# EAGLE board DRI-21700-flexpcb-12s4p (EAGLE 9.6.1)
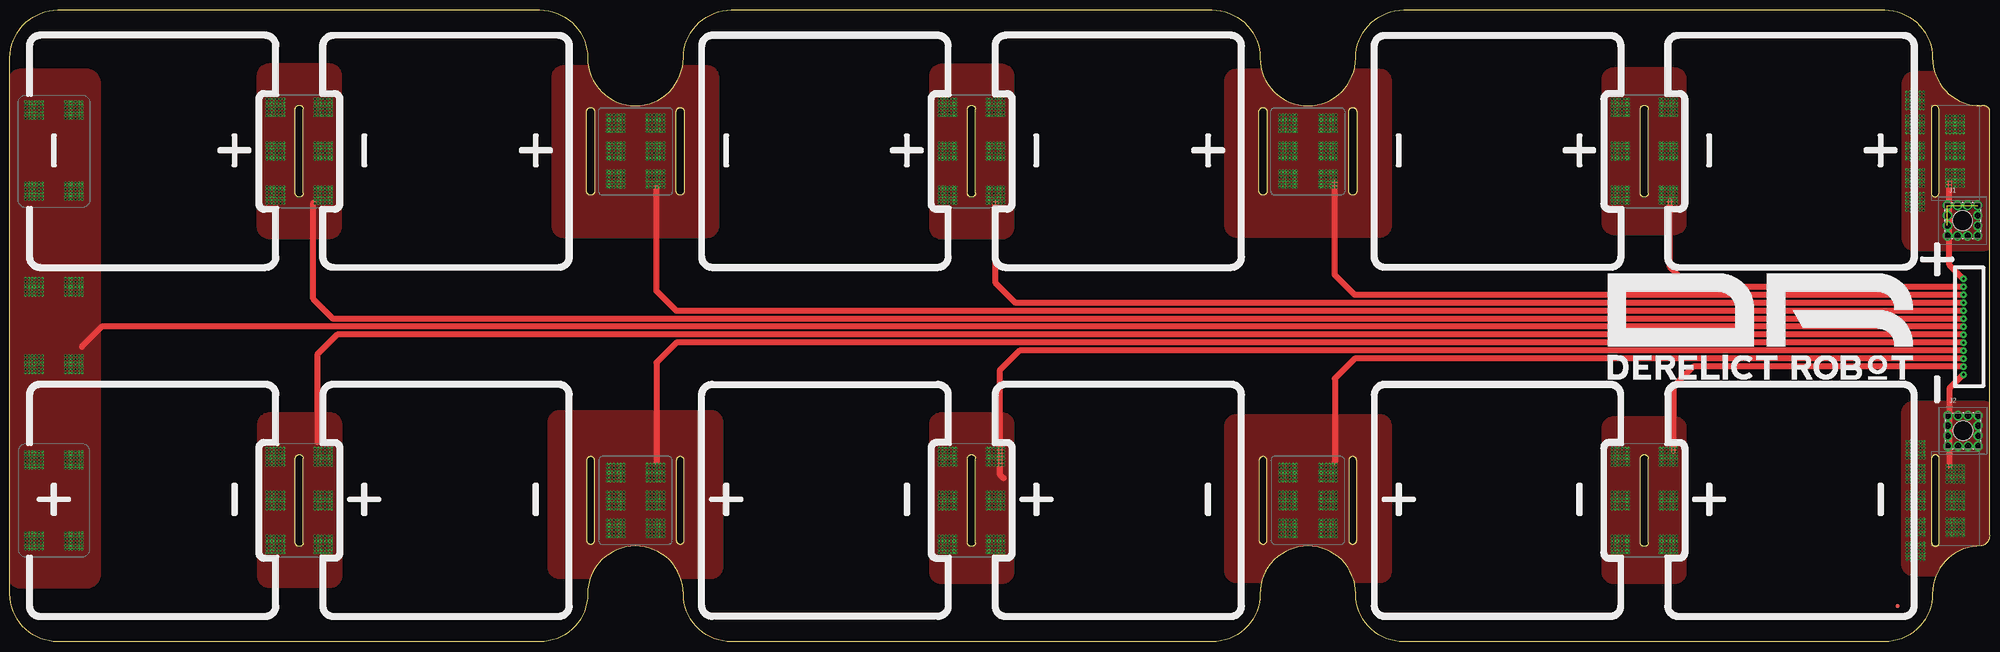
[diagram p1: board, top side]
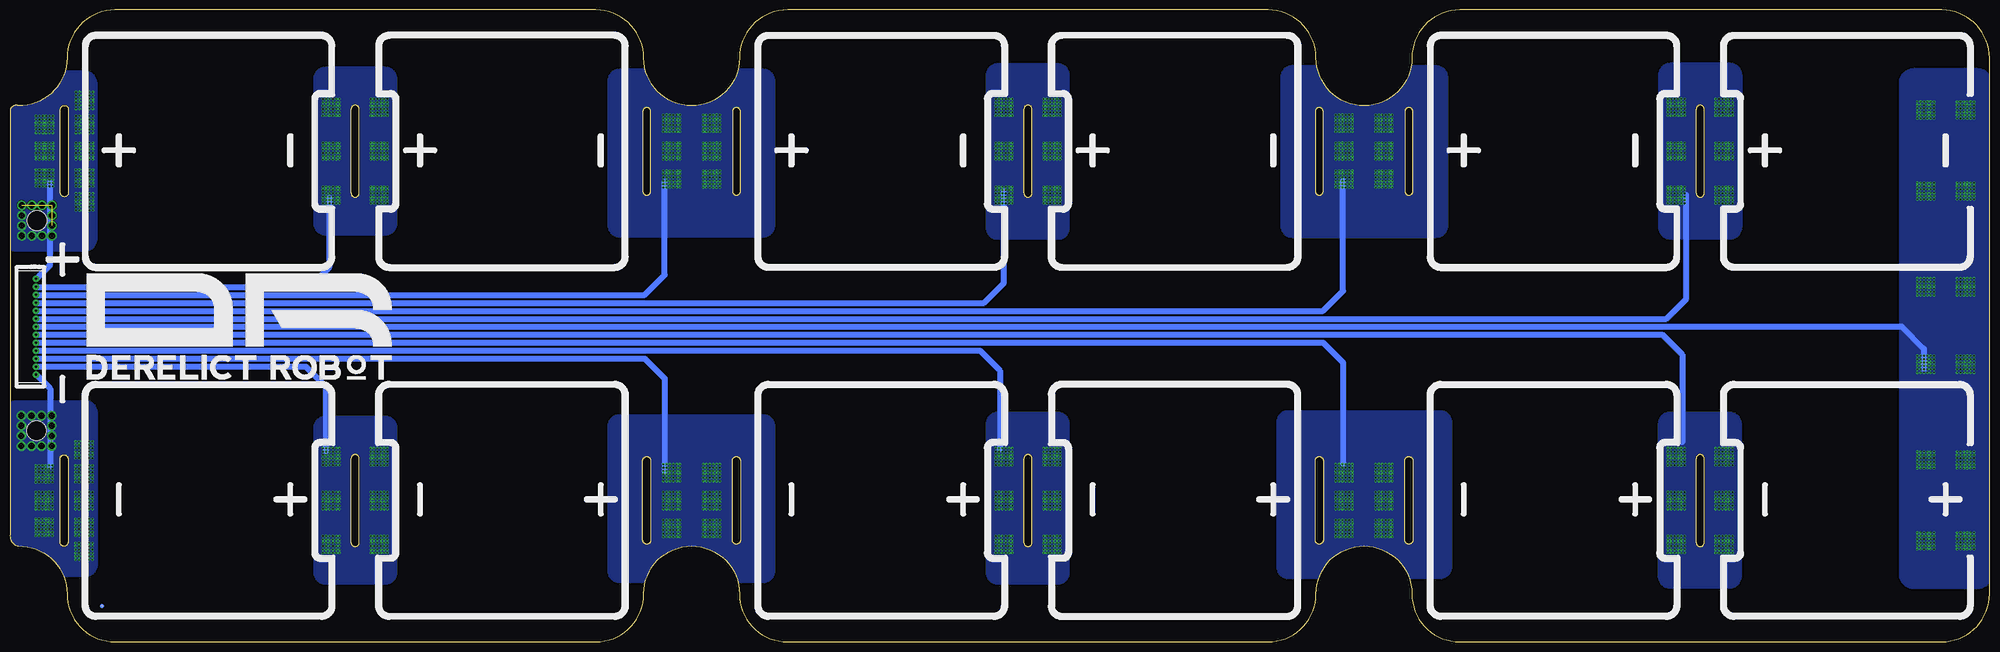
[diagram p2: board, bottom side, seen from below]

Size 496.05 x 158.4 mm. Coordinates in mm from the lower left corner, seen from the top.
Outline: 301.25,0 180.75,0 arc-90 168.75,12 arc180 144.75,12 arc-90 132.75,0 12,0 arc-90 0,12 0,146.4 arc-90 12,158.4 132.75,158.4 arc-90 144.75,146.4 arc180 168.75,146.4 arc-90 180.75,158.4 301.25,158.4 arc-90 313.25,146.4 arc180 337.25,146.4 arc-90 349.25,158.4 469.75,158.4 arc-90 481.75,146.4 arc91 493.96,134.4 arc-91 496,133.4 496,27 arc-91 493.96,24 arc91 481.75,12 arc-90 469.75,0 349.25,0 arc-90 337.25,12 arc180 313.25,12 arc-90 301.25,0
Outline: 166.97,112.95 166.97,132.95 arc-180 168.97,132.95 168.97,112.95 arc-180 166.97,112.95
Outline: 313.01,132.95 arc-180 315.01,132.95 315.01,112.95 arc-180 313.01,112.95 313.01,132.95
Outline: 146.51,112.95 arc-180 144.51,112.95 144.51,132.95 arc-180 146.51,132.95 146.51,112.95
Outline: 168.97,45.45 arc180 166.97,45.45 166.97,25.45 arc180 168.97,25.45 168.97,45.45
Outline: 337.47,132.95 337.47,112.95 arc-180 335.47,112.95 335.47,132.95 arc-180 337.47,132.95
Outline: 335.47,45.45 335.47,25.45 arc180 337.47,25.45 337.47,45.45 arc180 335.47,45.45
Outline: 315.01,25.45 315.01,45.45 arc180 313.01,45.45 313.01,25.45 arc180 315.01,25.45
Outline: 146.51,45.45 arc180 144.51,45.45 144.51,25.45 arc180 146.51,25.45 146.51,45.45
Copper layers (1*16): Top 0.035mm / dielectric 1.5mm / Bottom 0.035mm
Design rules "SparkFun-2-layer-FAB-LIMIT": minimum track width 4mil, minimum drill 6mil, track to track 4mil, track to pad 4mil, pad to pad 4mil, via to via 4mil, smd to smd 4mil, copper to edge 4mil, drill to drill 4mil, minimum pad ring 5mil, minimum via ring 5mil, stop-mask expansion 4mil, vias tented up to drill 25mil, thermal gap 10mil

## Footprints (pad centres in the part's own frame; a part is rotated, then mirrored left to right if it is on the bottom)
FIDUCIAL-1X2 = smd 1 x 1: 1 0,0
7460408 = drill 1.57 pad 2.3: 1 -3.81,-3.81; 2 -1.27,-3.81; 3 1.27,-3.81; 4 3.81,-3.81; 5 3.81,-1.27; 6 3.81,1.27; 7 3.81,3.81; 8 1.27,3.81; 9 -1.27,3.81; 10 -3.81,3.81; 11 -3.81,1.27; 12 -3.81,-1.27 | hole 5: 0,0
13P-JST-2MM = drill 0.7 pad 1.6: P$1 0,-12; P$2 0,-10; P$3 0,-8; P$4 0,-6; P$5 0,-4; P$6 0,-2; P$7 0,0; P$8 0,2; P$9 0,4; P$10 0,6; P$11 0,8; P$12 0,10; P$13 0,12
TERM-PAD- = drill 0.3 pad 0.6: P$3 -1.26,0.42; P$4 -0.42,0.42; P$5 -0.42,-0.42; P$6 0.42,-0.42; P$7 0.42,0.42; P$8 -2.1,0.42; P$9 -2.1,1.26; P$10 -2.1,2.1; P$11 -1.26,2.1; P$12 -1.26,1.26; P$13 -0.42,1.26; P$14 -0.42,2.1; P$15 0.42,2.1; P$16 0.42,1.26; P$17 1.26,1.26; P$18 1.26,2.1; P$19 2.1,2.1; P$20 2.1,1.26; P$21 2.1,0.42; P$22 1.26,0.42; P$23 1.26,-0.42; P$24 2.1,-0.42; P$25 -1.26,-0.42; P$26 -2.1,-0.42; P$27 -2.1,-1.26; P$28 -2.1,-2.1; P$29 -1.26,-2.1; P$30 -0.42,-2.1; P$31 0.42,-2.1; P$32 1.26,-2.1; P$33 2.1,-2.1; P$34 2.1,-1.26; P$35 1.26,-1.26; P$36 -0.42,-1.26; P$37 0.42,-1.26; P$38 -1.26,-1.26; P$39 -0.42,7.14; P$40 0.42,7.14; P$41 -1.26,7.14; P$42 -2.1,7.14; P$43 -2.1,7.98; P$44 -2.1,8.82; P$45 -1.26,8.82; P$46 -1.26,7.98; P$47 -0.42,7.98; P$48 -0.42,8.82; P$49 0.42,8.82; P$50 0.42,7.98; P$51 1.26,7.98; P$52 1.26,8.82; P$53 2.1,8.82; P$54 2.1,7.98; P$55 2.1,7.14; P$56 1.26,7.14; P$57 -0.42,4.62; P$58 0.42,4.62; P$59 -1.26,4.62; P$60 -2.1,4.62; P$61 -2.1,5.46; P$62 -2.1,6.3; P$63 -1.26,6.3; P$64 -1.26,5.46; P$65 -0.42,5.46; P$66 -0.42,6.3; P$67 0.42,6.3; P$68 0.42,5.46; P$69 1.26,5.46; P$70 1.26,6.3; P$71 2.1,6.3; P$72 2.1,5.46; P$73 2.1,4.62; P$74 1.26,4.62; P$75 -0.42,-8.82; P$76 0.42,-8.82; P$77 -1.26,-8.82; P$78 -2.1,-8.82; P$79 -2.1,-7.98; P$80 -2.1,-7.14; P$81 -1.26,-7.14; P$82 -1.26,-7.98; P$83 -0.42,-7.98; P$84 -0.42,-7.14; P$85 0.42,-7.14; P$86 0.42,-7.98; P$87 1.26,-7.98; P$88 1.26,-7.14; P$89 2.1,-7.14; P$90 2.1,-7.98; P$91 2.1,-8.82; P$92 1.26,-8.82; P$93 -0.42,-6.3; P$94 0.42,-6.3; P$95 -1.26,-6.3; P$96 -2.1,-6.3; P$97 -2.1,-5.46; P$98 -2.1,-4.62; P$99 -1.26,-4.62; P$100 -1.26,-5.46; P$101 -0.42,-5.46; P$102 -0.42,-4.62; P$103 0.42,-4.62; P$104 0.42,-5.46; P$105 1.26,-5.46; P$106 1.26,-4.62; P$107 2.1,-4.62; P$108 2.1,-5.46; P$109 2.1,-6.3; P$110 1.26,-6.3; P$181 -10.42,0.42; P$182 -10.42,-0.42; P$183 -9.58,-0.42; P$184 -9.58,0.42; P$185 -11.26,0.42; P$186 -12.1,0.42; P$187 -12.1,1.26; P$188 -12.1,2.1; P$189 -11.26,2.1; P$190 -11.26,1.26; P$191 -10.42,1.26; P$192 -10.42,2.1; P$193 -9.58,2.1; P$194 -9.58,1.26; P$195 -8.74,1.26; P$196 -8.74,2.1; P$197 -7.9,2.1; P$198 -7.9,1.26; P$199 -7.9,0.42; P$200 -8.74,0.42; P$201 -8.74,-0.42; P$202 -7.9,-0.42; P$203 -11.26,-0.42; P$204 -12.1,-0.42; P$205 -12.1,-1.26; P$206 -12.1,-2.1; P$207 -11.26,-2.1; P$208 -10.42,-2.1; P$209 -9.58,-2.1; P$210 -8.74,-2.1; P$211 -7.9,-2.1; P$212 -7.9,-1.26; P$213 -8.74,-1.26; P$214 -10.42,-1.26; P$215 -9.58,-1.26; P$216 -11.26,-1.26; P$217 -10.42,7.14; P$218 -9.58,7.14; P$219 -11.26,7.14; P$220 -12.1,7.14; P$221 -12.1,7.98; P$222 -12.1,8.82; P$223 -11.26,8.82; P$224 -11.26,7.98; P$225 -10.42,7.98; P$226 -10.42,8.82; P$227 -9.58,8.82; P$228 -9.58,7.98; P$229 -8.74,7.98; P$230 -8.74,8.82; P$231 -7.9,8.82; P$232 -7.9,7.98; P$233 -7.9,7.14; P$234 -8.74,7.14; P$235 -10.42,4.62; P$236 -9.58,4.62; P$237 -11.26,4.62; P$238 -12.1,4.62; P$239 -12.1,5.46; P$240 -12.1,6.3; P$241 -11.26,6.3; P$242 -11.26,5.46; P$243 -10.42,5.46; P$244 -10.42,6.3; P$245 -9.58,6.3; P$246 -9.58,5.46; P$247 -8.74,5.46; P$248 -8.74,6.3; P$249 -7.9,6.3; P$250 -7.9,5.46; P$251 -7.9,4.62; P$252 -8.74,4.62; P$253 -10.42,-8.82; P$254 -9.58,-8.82; P$255 -11.26,-8.82; P$256 -12.1,-8.82; P$257 -12.1,-7.98; P$258 -12.1,-7.14; P$259 -11.26,-7.14; P$260 -11.26,-7.98; P$261 -10.42,-7.98; P$262 -10.42,-7.14; P$263 -9.58,-7.14; P$264 -9.58,-7.98; P$265 -8.74,-7.98; P$266 -8.74,-7.14; P$267 -7.9,-7.14; P$268 -7.9,-7.98; P$269 -7.9,-8.82; P$270 -8.74,-8.82; P$271 -10.42,-6.3; P$272 -9.58,-6.3; P$273 -11.26,-6.3; P$274 -12.1,-6.3; P$275 -12.1,-5.46; P$276 -12.1,-4.62; P$277 -11.26,-4.62; P$278 -11.26,-5.46; P$279 -10.42,-5.46; P$280 -10.42,-4.62; P$281 -9.58,-4.62; P$282 -9.58,-5.46; P$283 -8.74,-5.46; P$284 -8.74,-4.62; P$285 -7.9,-4.62; P$286 -7.9,-5.46; P$287 -7.9,-6.3; P$288 -8.74,-6.3; P$289 -10.42,13.14; P$290 -9.58,13.14; P$291 -11.26,13.14; P$292 -12.1,13.14; P$293 -12.1,13.98; P$294 -12.1,14.82; P$295 -11.26,14.82; P$296 -11.26,13.98; P$297 -10.42,13.98; P$298 -10.42,14.82; P$299 -9.58,14.82; P$300 -9.58,13.98; P$301 -8.74,13.98; P$302 -8.74,14.82; P$303 -7.9,14.82; P$304 -7.9,13.98; P$305 -7.9,13.14; P$306 -8.74,13.14; P$307 -10.42,10.62; P$308 -9.58,10.62; P$309 -11.26,10.62; P$310 -12.1,10.62; P$311 -12.1,11.46; P$312 -12.1,12.3; P$313 -11.26,12.3; P$314 -11.26,11.46; P$315 -10.42,11.46; P$316 -10.42,12.3; P$317 -9.58,12.3; P$318 -9.58,11.46; P$319 -8.74,11.46; P$320 -8.74,12.3; P$321 -7.9,12.3; P$322 -7.9,11.46; P$323 -7.9,10.62; P$324 -8.74,10.62; P$325 -10.42,-14.82; P$326 -9.58,-14.82; P$327 -11.26,-14.82; P$328 -12.1,-14.82; P$329 -12.1,-13.98; P$330 -12.1,-13.14; P$331 -11.26,-13.14; P$332 -11.26,-13.98; P$333 -10.42,-13.98; P$334 -10.42,-13.14; P$335 -9.58,-13.14; P$336 -9.58,-13.98; P$337 -8.74,-13.98; P$338 -8.74,-13.14; P$339 -7.9,-13.14; P$340 -7.9,-13.98; P$341 -7.9,-14.82; P$342 -8.74,-14.82; P$343 -10.42,-12.3; P$344 -9.58,-12.3; P$345 -11.26,-12.3; P$346 -12.1,-12.3; P$347 -12.1,-11.46; P$348 -12.1,-10.62; P$349 -11.26,-10.62; P$350 -11.26,-11.46; P$351 -10.42,-11.46; P$352 -10.42,-10.62; P$353 -9.58,-10.62; P$354 -9.58,-11.46; P$355 -8.74,-11.46; P$356 -8.74,-10.62; P$357 -7.9,-10.62; P$358 -7.9,-11.46; P$359 -7.9,-12.3; P$360 -8.74,-12.3
BAT-TERM-L = drill 0.3 pad 0.6: P$5 -6.42,0.42; P$6 -5.58,0.42; P$7 -5.58,-0.42; P$8 -6.42,-0.42; P$9 -6.42,-1.26; P$10 -6.42,-2.1; P$11 -7.26,-2.1; P$12 -8.1,-2.1; P$13 -5.58,1.26; P$14 -5.58,2.1; P$15 -4.74,2.1; P$16 -3.9,2.1; P$17 -4.74,0.42; P$18 -3.9,0.42; P$19 -3.9,1.26; P$20 -4.74,1.26; P$21 -4.74,-1.26; P$22 -4.74,-0.42; P$23 -3.9,-0.42; P$24 -3.9,-1.26; P$25 -3.9,-2.1; P$26 -4.74,-2.1; P$27 -5.58,-2.1; P$28 -5.58,-1.26; P$29 -7.26,-1.26; P$30 -8.1,-1.26; P$31 -8.1,-0.42; P$32 -7.26,-0.42; P$33 -7.26,0.42; P$34 -8.1,0.42; P$35 -8.1,1.26; P$36 -7.26,1.26; P$37 -7.26,2.1; P$38 -8.1,2.1; P$39 -6.42,1.26; P$40 -6.42,2.1; P$41 -6.42,-10.58; P$42 5.58,0.42; P$43 6.42,0.42; P$44 6.42,-0.42; P$45 5.58,-0.42; P$46 5.58,-1.26; P$47 5.58,-2.1; P$48 4.74,-2.1; P$49 3.9,-2.1; P$50 6.42,1.26; P$51 6.42,2.1; P$52 7.26,2.1; P$53 8.1,2.1; P$54 7.26,0.42; P$55 8.1,0.42; P$56 8.1,1.26; P$57 7.26,1.26; P$58 7.26,-1.26; P$59 7.26,-0.42; P$60 8.1,-0.42; P$61 8.1,-1.26; P$62 8.1,-2.1; P$63 7.26,-2.1; P$64 6.42,-2.1; P$65 6.42,-1.26; P$66 4.74,-1.26; P$67 3.9,-1.26; P$68 3.9,-0.42; P$69 4.74,-0.42; P$70 4.74,0.42; P$71 3.9,0.42; P$72 3.9,1.26; P$73 4.74,1.26; P$74 4.74,2.1; P$75 3.9,2.1; P$76 5.58,1.26; P$77 5.58,2.1; P$78 -5.58,-10.58; P$79 -5.58,-11.42; P$80 -6.42,-11.42; P$81 -6.42,-12.26; P$82 -6.42,-13.1; P$83 -7.26,-13.1; P$84 -8.1,-13.1; P$85 -5.58,-9.74; P$86 -5.58,-8.9; P$87 -4.74,-8.9; P$88 -3.9,-8.9; P$89 -4.74,-10.58; P$90 -3.9,-10.58; P$91 -3.9,-9.74; P$92 -4.74,-9.74; P$93 -4.74,-12.26; P$94 -4.74,-11.42; P$95 -3.9,-11.42; P$96 -3.9,-12.26; P$97 -3.9,-13.1; P$98 -4.74,-13.1; P$99 -5.58,-13.1; P$100 -5.58,-12.26; P$101 -7.26,-12.26; P$102 -8.1,-12.26; P$103 -8.1,-11.42; P$104 -7.26,-11.42; P$105 -7.26,-10.58; P$106 -8.1,-10.58; P$107 -8.1,-9.74; P$108 -7.26,-9.74; P$109 -7.26,-8.9; P$110 -8.1,-8.9; P$111 -6.42,-9.74; P$112 -6.42,-8.9; P$114 -6.42,11.42; P$115 -5.58,11.42; P$116 -5.58,10.58; P$117 -6.42,10.58; P$118 -6.42,9.74; P$119 -6.42,8.9; P$120 -7.26,8.9; P$121 -8.1,8.9; P$122 -5.58,12.26; P$123 -5.58,13.1; P$124 -4.74,13.1; P$125 -3.9,13.1; P$126 -4.74,11.42; P$127 -3.9,11.42; P$128 -3.9,12.26; P$129 -4.74,12.26; P$130 -4.74,9.74; P$131 -4.74,10.58; P$132 -3.9,10.58; P$133 -3.9,9.74; P$134 -3.9,8.9; P$135 -4.74,8.9; P$136 -5.58,8.9; P$137 -5.58,9.74; P$138 -7.26,9.74; P$139 -8.1,9.74; P$140 -8.1,10.58; P$141 -7.26,10.58; P$142 -7.26,11.42; P$143 -8.1,11.42; P$144 -8.1,12.26; P$145 -7.26,12.26; P$146 -7.26,13.1; P$147 -8.1,13.1; P$148 -6.42,12.26; P$149 -6.42,13.1; P$151 5.58,11.42; P$152 6.42,11.42; P$153 6.42,10.58; P$154 5.58,10.58; P$155 5.58,9.74; P$156 5.58,8.9; P$157 4.74,8.9; P$158 3.9,8.9; P$159 6.42,12.26; P$160 6.42,13.1; P$161 7.26,13.1; P$162 8.1,13.1; P$163 7.26,11.42; P$164 8.1,11.42; P$165 8.1,12.26; P$166 7.26,12.26; P$167 7.26,9.74; P$168 7.26,10.58; P$169 8.1,10.58; P$170 8.1,9.74; P$171 8.1,8.9; P$172 7.26,8.9; P$173 6.42,8.9; P$174 6.42,9.74; P$175 4.74,9.74; P$176 3.9,9.74; P$177 3.9,10.58; P$178 4.74,10.58; P$179 4.74,11.42; P$180 3.9,11.42; P$181 3.9,12.26; P$182 4.74,12.26; P$183 4.74,13.1; P$184 3.9,13.1; P$185 5.58,12.26; P$186 5.58,13.1; P$188 5.58,-10.58; P$189 6.42,-10.58; P$190 6.42,-11.42; P$191 5.58,-11.42; P$192 5.58,-12.26; P$193 5.58,-13.1; P$194 4.74,-13.1; P$195 3.9,-13.1; P$196 6.42,-9.74; P$197 6.42,-8.9; P$198 7.26,-8.9; P$199 8.1,-8.9; P$200 7.26,-10.58; P$201 8.1,-10.58; P$202 8.1,-9.74; P$203 7.26,-9.74; P$204 7.26,-12.26; P$205 7.26,-11.42; P$206 8.1,-11.42; P$207 8.1,-12.26; P$208 8.1,-13.1; P$209 7.26,-13.1; P$210 6.42,-13.1; P$211 6.42,-12.26; P$212 4.74,-12.26; P$213 3.9,-12.26; P$214 3.9,-11.42; P$215 4.74,-11.42; P$216 4.74,-10.58; P$217 3.9,-10.58; P$218 3.9,-9.74; P$219 4.74,-9.74; P$220 4.74,-8.9; P$221 3.9,-8.9; P$222 5.58,-9.74; P$223 5.58,-8.9
BAT-TERM-M = drill 0.3 pad 0.6: P$5 -5.42,0.42; P$6 -5.42,-0.42; P$7 -4.58,-0.42; P$8 -4.58,0.42; P$9 -3.74,0.42; P$10 -2.9,0.42; P$11 -2.9,1.26; P$12 -2.9,2.1; P$13 -3.74,-0.42; P$14 -2.9,-0.42; P$15 -2.9,-1.26; P$16 -2.9,-2.1; P$17 -3.74,-2.1; P$18 -4.58,-2.1; P$19 -5.42,-2.1; P$20 -6.26,-2.1; P$21 -7.1,-2.1; P$22 -7.1,-1.26; P$23 -7.1,-0.42; P$24 -6.26,-0.42; P$25 -6.26,-1.26; P$26 -5.42,-1.26; P$27 -4.58,-1.26; P$28 -3.74,-1.26; P$29 -3.74,1.26; P$30 -3.74,2.1; P$31 -4.58,2.1; P$32 -4.58,1.26; P$33 -5.42,1.26; P$34 -5.42,2.1; P$35 -6.26,2.1; P$36 -6.26,1.26; P$37 -6.26,0.42; P$38 -7.1,0.42; P$39 -7.1,1.26; P$40 -7.1,2.1; P$42 4.58,0.42; P$43 4.58,-0.42; P$44 5.42,-0.42; P$45 5.42,0.42; P$46 6.26,0.42; P$47 7.1,0.42; P$48 7.1,1.26; P$49 7.1,2.1; P$50 6.26,-0.42; P$51 7.1,-0.42; P$52 7.1,-1.26; P$53 7.1,-2.1; P$54 6.26,-2.1; P$55 5.42,-2.1; P$56 4.58,-2.1; P$57 3.74,-2.1; P$58 2.9,-2.1; P$59 2.9,-1.26; P$60 2.9,-0.42; P$61 3.74,-0.42; P$62 3.74,-1.26; P$63 4.58,-1.26; P$64 5.42,-1.26; P$65 6.26,-1.26; P$66 6.26,1.26; P$67 6.26,2.1; P$68 5.42,2.1; P$69 5.42,1.26; P$70 4.58,1.26; P$71 4.58,2.1; P$72 3.74,2.1; P$73 3.74,1.26; P$74 3.74,0.42; P$75 2.9,0.42; P$76 2.9,1.26; P$77 2.9,2.1; P$79 -5.42,7.42; P$80 -5.42,6.58; P$81 -4.58,6.58; P$82 -4.58,7.42; P$83 -3.74,7.42; P$84 -2.9,7.42; P$85 -2.9,8.26; P$86 -2.9,9.1; P$87 -3.74,6.58; P$88 -2.9,6.58; P$89 -2.9,5.74; P$90 -2.9,4.9; P$91 -3.74,4.9; P$92 -4.58,4.9; P$93 -5.42,4.9; P$94 -6.26,4.9; P$95 -7.1,4.9; P$96 -7.1,5.74; P$97 -7.1,6.58; P$98 -6.26,6.58; P$99 -6.26,5.74; P$100 -5.42,5.74; P$101 -4.58,5.74; P$102 -3.74,5.74; P$103 -3.74,8.26; P$104 -3.74,9.1; P$105 -4.58,9.1; P$106 -4.58,8.26; P$107 -5.42,8.26; P$108 -5.42,9.1; P$109 -6.26,9.1; P$110 -6.26,8.26; P$111 -6.26,7.42; P$112 -7.1,7.42; P$113 -7.1,8.26; P$114 -7.1,9.1; P$116 -5.42,-6.58; P$117 -5.42,-7.42; P$118 -4.58,-7.42; P$119 -4.58,-6.58; P$120 -3.74,-6.58; P$121 -2.9,-6.58; P$122 -2.9,-5.74; P$123 -2.9,-4.9; P$124 -3.74,-7.42; P$125 -2.9,-7.42; P$126 -2.9,-8.26; P$127 -2.9,-9.1; P$128 -3.74,-9.1; P$129 -4.58,-9.1; P$130 -5.42,-9.1; P$131 -6.26,-9.1; P$132 -7.1,-9.1; P$133 -7.1,-8.26; P$134 -7.1,-7.42; P$135 -6.26,-7.42; P$136 -6.26,-8.26; P$137 -5.42,-8.26; P$138 -4.58,-8.26; P$139 -3.74,-8.26; P$140 -3.74,-5.74; P$141 -3.74,-4.9; P$142 -4.58,-4.9; P$143 -4.58,-5.74; P$144 -5.42,-5.74; P$145 -5.42,-4.9; P$146 -6.26,-4.9; P$147 -6.26,-5.74; P$148 -6.26,-6.58; P$149 -7.1,-6.58; P$150 -7.1,-5.74; P$151 -7.1,-4.9; P$153 4.58,-6.58; P$154 4.58,-7.42; P$155 5.42,-7.42; P$156 5.42,-6.58; P$157 6.26,-6.58; P$158 7.1,-6.58; P$159 7.1,-5.74; P$160 7.1,-4.9; P$161 6.26,-7.42; P$162 7.1,-7.42; P$163 7.1,-8.26; P$164 7.1,-9.1; P$165 6.26,-9.1; P$166 5.42,-9.1; P$167 4.58,-9.1; P$168 3.74,-9.1; P$169 2.9,-9.1; P$170 2.9,-8.26; P$171 2.9,-7.42; P$172 3.74,-7.42; P$173 3.74,-8.26; P$174 4.58,-8.26; P$175 5.42,-8.26; P$176 6.26,-8.26; P$177 6.26,-5.74; P$178 6.26,-4.9; P$179 5.42,-4.9; P$180 5.42,-5.74; P$181 4.58,-5.74; P$182 4.58,-4.9; P$183 3.74,-4.9; P$184 3.74,-5.74; P$185 3.74,-6.58; P$186 2.9,-6.58; P$187 2.9,-5.74; P$188 2.9,-4.9; P$190 4.58,7.42; P$191 4.58,6.58; P$192 5.42,6.58; P$193 5.42,7.42; P$194 6.26,7.42; P$195 7.1,7.42; P$196 7.1,8.26; P$197 7.1,9.1; P$198 6.26,6.58; P$199 7.1,6.58; P$200 7.1,5.74; P$201 7.1,4.9; P$202 6.26,4.9; P$203 5.42,4.9; P$204 4.58,4.9; P$205 3.74,4.9; P$206 2.9,4.9; P$207 2.9,5.74; P$208 2.9,6.58; P$209 3.74,6.58; P$210 3.74,5.74; P$211 4.58,5.74; P$212 5.42,5.74; P$213 6.26,5.74; P$214 6.26,8.26; P$215 6.26,9.1; P$216 5.42,9.1; P$217 5.42,8.26; P$218 4.58,8.26; P$219 4.58,9.1; P$220 3.74,9.1; P$221 3.74,8.26; P$222 3.74,7.42; P$223 2.9,7.42; P$224 2.9,8.26; P$225 2.9,9.1
BAT-TERM-END = drill 0.3 pad 0.6: P$2 3.58,4.42; P$3 3.58,3.58; P$4 4.42,3.58; P$5 4.42,4.42; P$6 3.58,5.26; P$7 3.58,6.1; P$8 2.74,6.1; P$9 1.9,6.1; P$10 1.9,5.26; P$11 1.9,4.42; P$12 1.9,3.58; P$13 1.9,2.74; P$14 1.9,1.9; P$15 2.74,1.9; P$16 3.58,1.9; P$17 5.26,1.9; P$18 4.42,1.9; P$19 6.1,1.9; P$20 6.1,2.74; P$21 6.1,3.58; P$22 6.1,4.42; P$23 6.1,5.26; P$24 6.1,6.1; P$25 5.26,6.1; P$26 4.42,6.1; P$27 4.42,5.26; P$28 5.26,5.26; P$29 5.26,4.42; P$30 5.26,3.58; P$31 5.26,2.74; P$32 4.42,2.74; P$33 3.58,2.74; P$34 2.74,2.74; P$35 2.74,3.58; P$36 2.74,4.42; P$37 2.74,5.26; P$39 13.58,4.42; P$40 13.58,3.58; P$41 14.42,3.58; P$42 14.42,4.42; P$43 13.58,5.26; P$44 13.58,6.1; P$45 12.74,6.1; P$46 11.9,6.1; P$47 11.9,5.26; P$48 11.9,4.42; P$49 11.9,3.58; P$50 11.9,2.74; P$51 11.9,1.9; P$52 12.74,1.9; P$53 13.58,1.9; P$54 15.26,1.9; P$55 14.42,1.9; P$56 16.1,1.9; P$57 16.1,2.74; P$58 16.1,3.58; P$59 16.1,4.42; P$60 16.1,5.26; P$61 16.1,6.1; P$62 15.26,6.1; P$63 14.42,6.1; P$64 14.42,5.26; P$65 15.26,5.26; P$66 15.26,4.42; P$67 15.26,3.58; P$68 15.26,2.74; P$69 14.42,2.74; P$70 13.58,2.74; P$71 12.74,2.74; P$72 12.74,3.58; P$73 12.74,4.42; P$74 12.74,5.26; P$76 3.58,24.72; P$77 3.58,23.88; P$78 4.42,23.88; P$79 4.42,24.72; P$80 3.58,25.56; P$81 3.58,26.4; P$82 2.74,26.4; P$83 1.9,26.4; P$84 1.9,25.56; P$85 1.9,24.72; P$86 1.9,23.88; P$87 1.9,23.04; P$88 1.9,22.2; P$89 2.74,22.2; P$90 3.58,22.2; P$91 5.26,22.2; P$92 4.42,22.2; P$93 6.1,22.2; P$94 6.1,23.04; P$95 6.1,23.88; P$96 6.1,24.72; P$97 6.1,25.56; P$98 6.1,26.4; P$99 5.26,26.4; P$100 4.42,26.4; P$101 4.42,25.56; P$102 5.26,25.56; P$103 5.26,24.72; P$104 5.26,23.88; P$105 5.26,23.04; P$106 4.42,23.04; P$107 3.58,23.04; P$108 2.74,23.04; P$109 2.74,23.88; P$110 2.74,24.72; P$111 2.74,25.56; P$113 13.58,24.72; P$114 13.58,23.88; P$115 14.42,23.88; P$116 14.42,24.72; P$117 13.58,25.56; P$118 13.58,26.4; P$119 12.74,26.4; P$120 11.9,26.4; P$121 11.9,25.56; P$122 11.9,24.72; P$123 11.9,23.88; P$124 11.9,23.04; P$125 11.9,22.2; P$126 12.74,22.2; P$127 13.58,22.2; P$128 15.26,22.2; P$129 14.42,22.2; P$130 16.1,22.2; P$131 16.1,23.04; P$132 16.1,23.88; P$133 16.1,24.72; P$134 16.1,25.56; P$135 16.1,26.4; P$136 15.26,26.4; P$137 14.42,26.4; P$138 14.42,25.56; P$139 15.26,25.56; P$140 15.26,24.72; P$141 15.26,23.88; P$142 15.26,23.04; P$143 14.42,23.04; P$144 13.58,23.04; P$145 12.74,23.04; P$146 12.74,23.88; P$147 12.74,24.72; P$148 12.74,25.56; P$150 14.42,111.58; P$151 14.42,112.42; P$152 13.58,112.42; P$153 13.58,111.58; P$154 14.42,110.74; P$155 14.42,109.9; P$156 15.26,109.9; P$157 16.1,109.9; P$158 16.1,110.74; P$159 16.1,111.58; P$160 16.1,112.42; P$161 16.1,113.26; P$162 16.1,114.1; P$163 15.26,114.1; P$164 14.42,114.1; P$165 12.74,114.1; P$166 13.58,114.1; P$167 11.9,114.1; P$168 11.9,113.26; P$169 11.9,112.42; P$170 11.9,111.58; P$171 11.9,110.74; P$172 11.9,109.9; P$173 12.74,109.9; P$174 13.58,109.9; P$175 13.58,110.74; P$176 12.74,110.74; P$177 12.74,111.58; P$178 12.74,112.42; P$179 12.74,113.26; P$180 13.58,113.26; P$181 14.42,113.26; P$182 15.26,113.26; P$183 15.26,112.42; P$184 15.26,111.58; P$185 15.26,110.74; P$187 4.42,111.58; P$188 4.42,112.42; P$189 3.58,112.42; P$190 3.58,111.58; P$191 4.42,110.74; P$192 4.42,109.9; P$193 5.26,109.9; P$194 6.1,109.9; P$195 6.1,110.74; P$196 6.1,111.58; P$197 6.1,112.42; P$198 6.1,113.26; P$199 6.1,114.1; P$200 5.26,114.1; P$201 4.42,114.1; P$202 2.74,114.1; P$203 3.58,114.1; P$204 1.9,114.1; P$205 1.9,113.26; P$206 1.9,112.42; P$207 1.9,111.58; P$208 1.9,110.74; P$209 1.9,109.9; P$210 2.74,109.9; P$211 3.58,109.9; P$212 3.58,110.74; P$213 2.74,110.74; P$214 2.74,111.58; P$215 2.74,112.42; P$216 2.74,113.26; P$217 3.58,113.26; P$218 4.42,113.26; P$219 5.26,113.26; P$220 5.26,112.42; P$221 5.26,111.58; P$222 5.26,110.74; P$224 14.42,91.28; P$225 14.42,92.12; P$226 13.58,92.12; P$227 13.58,91.28; P$228 14.42,90.44; P$229 14.42,89.6; P$230 15.26,89.6; P$231 16.1,89.6; P$232 16.1,90.44; P$233 16.1,91.28; P$234 16.1,92.12; P$235 16.1,92.96; P$236 16.1,93.8; P$237 15.26,93.8; P$238 14.42,93.8; P$239 12.74,93.8; P$240 13.58,93.8; P$241 11.9,93.8; P$242 11.9,92.96; P$243 11.9,92.12; P$244 11.9,91.28; P$245 11.9,90.44; P$246 11.9,89.6; P$247 12.74,89.6; P$248 13.58,89.6; P$249 13.58,90.44; P$250 12.74,90.44; P$251 12.74,91.28; P$252 12.74,92.12; P$253 12.74,92.96; P$254 13.58,92.96; P$255 14.42,92.96; P$256 15.26,92.96; P$257 15.26,92.12; P$258 15.26,91.28; P$259 15.26,90.44; P$261 4.42,91.28; P$262 4.42,92.12; P$263 3.58,92.12; P$264 3.58,91.28; P$265 4.42,90.44; P$266 4.42,89.6; P$267 5.26,89.6; P$268 6.1,89.6; P$269 6.1,90.44; P$270 6.1,91.28; P$271 6.1,92.12; P$272 6.1,92.96; P$273 6.1,93.8; P$274 5.26,93.8; P$275 4.42,93.8; P$276 2.74,93.8; P$277 3.58,93.8; P$278 1.9,93.8; P$279 1.9,92.96; P$280 1.9,92.12; P$281 1.9,91.28; P$282 1.9,90.44; P$283 1.9,89.6; P$284 2.74,89.6; P$285 3.58,89.6; P$286 3.58,90.44; P$287 2.74,90.44; P$288 2.74,91.28; P$289 2.74,92.12; P$290 2.74,92.96; P$291 3.58,92.96; P$292 4.42,92.96; P$293 5.26,92.96; P$294 5.26,92.12; P$295 5.26,91.28; P$296 5.26,90.44; P$433 14.42,67.28; P$434 14.42,68.12; P$435 13.58,68.12; P$436 13.58,67.28; P$437 14.42,66.44; P$438 14.42,65.6; P$439 15.26,65.6; P$440 16.1,65.6; P$441 16.1,66.44; P$442 16.1,67.28; P$443 16.1,68.12; P$444 16.1,68.96; P$445 16.1,69.8; P$446 15.26,69.8; P$447 14.42,69.8; P$448 12.74,69.8; P$449 13.58,69.8; P$450 11.9,69.8; P$451 11.9,68.96; P$452 11.9,68.12; P$453 11.9,67.28; P$454 11.9,66.44; P$455 11.9,65.6; P$456 12.74,65.6; P$457 13.58,65.6; P$458 13.58,66.44; P$459 12.74,66.44; P$460 12.74,67.28; P$461 12.74,68.12; P$462 12.74,68.96; P$463 13.58,68.96; P$464 14.42,68.96; P$465 15.26,68.96; P$466 15.26,68.12; P$467 15.26,67.28; P$468 15.26,66.44; P$469 4.42,67.28; P$470 4.42,68.12; P$471 3.58,68.12; P$472 3.58,67.28; P$473 4.42,66.44; P$474 4.42,65.6; P$475 5.26,65.6; P$476 6.1,65.6; P$477 6.1,66.44; P$478 6.1,67.28; P$479 6.1,68.12; P$480 6.1,68.96; P$481 6.1,69.8; P$482 5.26,69.8; P$483 4.42,69.8; P$484 2.74,69.8; P$485 3.58,69.8; P$486 1.9,69.8; P$487 1.9,68.96; P$488 1.9,68.12; P$489 1.9,67.28; P$490 1.9,66.44; P$491 1.9,65.6; P$492 2.74,65.6; P$493 3.58,65.6; P$494 3.58,66.44; P$495 2.74,66.44; P$496 2.74,67.28; P$497 2.74,68.12; P$498 2.74,68.96; P$499 3.58,68.96; P$500 4.42,68.96; P$501 5.26,68.96; P$502 5.26,68.12; P$503 5.26,67.28; P$504 5.26,66.44; P$505 3.58,48.72; P$506 3.58,47.88; P$507 4.42,47.88; P$508 4.42,48.72; P$509 3.58,49.56; P$510 3.58,50.4; P$511 2.74,50.4; P$512 1.9,50.4; P$513 1.9,49.56; P$514 1.9,48.72; P$515 1.9,47.88; P$516 1.9,47.04; P$517 1.9,46.2; P$518 2.74,46.2; P$519 3.58,46.2; P$520 5.26,46.2; P$521 4.42,46.2; P$522 6.1,46.2; P$523 6.1,47.04; P$524 6.1,47.88; P$525 6.1,48.72; P$526 6.1,49.56; P$527 6.1,50.4; P$528 5.26,50.4; P$529 4.42,50.4; P$530 4.42,49.56; P$531 5.26,49.56; P$532 5.26,48.72; P$533 5.26,47.88; P$534 5.26,47.04; P$535 4.42,47.04; P$536 3.58,47.04; P$537 2.74,47.04; P$538 2.74,47.88; P$539 2.74,48.72; P$540 2.74,49.56; P$541 13.58,48.72; P$542 13.58,47.88; P$543 14.42,47.88; P$544 14.42,48.72; P$545 13.58,49.56; P$546 13.58,50.4; P$547 12.74,50.4; P$548 11.9,50.4; P$549 11.9,49.56; P$550 11.9,48.72; P$551 11.9,47.88; P$552 11.9,47.04; P$553 11.9,46.2; P$554 12.74,46.2; P$555 13.58,46.2; P$556 15.26,46.2; P$557 14.42,46.2; P$558 16.1,46.2; P$559 16.1,47.04; P$560 16.1,47.88; P$561 16.1,48.72; P$562 16.1,49.56; P$563 16.1,50.4; P$564 15.26,50.4; P$565 14.42,50.4; P$566 14.42,49.56; P$567 15.26,49.56; P$568 15.26,48.72; P$569 15.26,47.88; P$570 15.26,47.04; P$571 14.42,47.04; P$572 13.58,47.04; P$573 12.74,47.04; P$574 12.74,47.88; P$575 12.74,48.72; P$576 12.74,49.56

## Placement (x,y rotation side)
FD1  FIDUCIAL1X2  [FIDUCIAL-1X2]  473,9 0 top
FD2  FIDUCIAL1X2  [FIDUCIAL-1X2]  473,9 0 bottom
J1  7460408  [7460408]  489.3,105.6 0 top
J2  7460408  [7460408]  489.4,52.9 0 top
JP1  13P-JST-2MM  [13P-JST-2MM]  489.52,78.98 0 bottom
P0  BUS-TERM-PAD+  [TERM-PAD-]  487.5,35.4 0 top
P1  BAT-TERM-L  [BAT-TERM-L]  409.55,35.4 0 top
P2  BAT-TERM-M  [BAT-TERM-M]  325.25,35.4 0 top
P3  BAT-TERM-L  [BAT-TERM-L]  240.95,35.4 0 top
P4  BAT-TERM-M  [BAT-TERM-M]  156.75,35.4 0 top
P5  BAT-TERM-L  [BAT-TERM-L]  72.5,35.4 0 top
P6  BAT-TERM-END  [BAT-TERM-END]  2,21.3 0 top
P7  BAT-TERM-L  [BAT-TERM-L]  72.5,123 0 top
P8  BAT-TERM-M  [BAT-TERM-M]  156.75,123 0 top
P9  BAT-TERM-L  [BAT-TERM-L]  240.95,123 0 top
P10  BAT-TERM-M  [BAT-TERM-M]  325.25,123 0 top
P11  BAT-TERM-L  [BAT-TERM-L]  409.55,123 0 top
P12  BUS-TERM-PAD+  [TERM-PAD-]  487.4,123 0 top

## Tracks (layer width: path | path; a pad name or v marks a point on that pad's centre or on a via)
N$2  (5 unrouted)
P0-
  Top 1.5: 486,44 486,63.46 JP1.P$1
  Bottom 1.5: JP1.P$1 486,63.46 486,44
  pour Bottom (no thermals): 497.4,57.4 497.4,19.4 arc-90 494.4,16.4 477.1,16.4 arc-90 474.1,19.4 474.1,57.4 arc-90 477.1,60.4 494.4,60.4 arc-90
  pour Top (no thermals): 474.1,19.4 474.1,57.4 arc-90 477.1,60.4 494.4,60.4 arc-90 497.4,57.4 497.4,19.4 arc-90 494.4,16.4 477.1,16.4 arc-90
P1
  Top 1.5: JP1.P$2 421.86,68.98 416.86,63.98 416.86,47.86
  Bottom 1.5: JP1.P$2 421.9,68.98 416.9,63.98 416.9,47.8
  pour Top (no thermals): 399,17.5 399,53.5 arc-90 402,56.5 417,56.5 arc-90 420,53.5 420,17.5 arc-90 417,14.5 402,14.5 arc-90
  pour Bottom (no thermals): 399,17.5 399,53.5 arc-90 402,56.5 417,56.5 arc-90 420,53.5 420,17.5 arc-90 417,14.5 402,14.5 arc-90
P2
  Top 1.5: JP1.P$3 337,70.98 332,65.98 332,45
  Bottom 1.5: JP1.P$3 337,70.98 332,65.98 332,42.62
  pour Top (no thermals): 343.3,56.9 307.3,56.9 arc90 304.3,53.9 304.3,17.9 arc90 307.3,14.9 343.3,14.9 arc90 346.3,17.9 346.3,53.9 arc90
  pour Bottom (no thermals): 343.3,14.9 307.3,14.9 arc-90 304.3,17.9 304.3,53.9 arc-90 307.3,56.9 343.3,56.9 arc-90 346.3,53.9 346.3,17.9 arc-90
P3
  Top 1.5: JP1.P$4 253,72.98 248,67.98 248,42 249,41
  Bottom 1.5: JP1.P$4 253,72.98 248,67.98 248,48.34
  pour Top (no thermals): 230.5,17.5 230.5,54.5 arc-90 233.5,57.5 248.5,57.5 arc-90 251.5,54.5 251.5,17.5 arc-90 248.5,14.5 233.5,14.5 arc-90
  pour Bottom (no thermals): 230.5,17.5 230.5,54.5 arc-90 233.5,57.5 248.5,57.5 arc-90 251.5,54.5 251.5,17.5 arc-90 248.5,14.5 233.5,14.5 arc-90
P4
  Top 1.5: JP1.P$5 167,74.98 162,69.98 162,45
  Bottom 1.5: JP1.P$5 167,74.98 162,69.98 162,44.67
  pour Top (no thermals): 178.7,18.9 178.7,54.9 arc90 175.7,57.9 137.7,57.9 arc90 134.7,54.9 134.7,18.9 arc90 137.7,15.9 175.7,15.9 arc90
  pour Bottom (no thermals): 137.7,57.9 175.7,57.9 arc-90 178.7,54.9 178.7,18.9 arc-90 175.7,15.9 137.7,15.9 arc-90 134.7,18.9 134.7,54.9 arc-90
P5
  Top 1.5: JP1.P$6 82,76.98 77,71.98 77,50
  Bottom 1.5: JP1.P$6 82,76.98 77,71.98 77,50
  pour Bottom (no thermals): 62.1,16.5 62.1,54.5 arc-90 65.1,57.5 80.1,57.5 arc-90 83.1,54.5 83.1,16.5 arc-90 80.1,13.5 65.1,13.5 arc-90
  pour Top (no thermals): 62.1,16.5 62.1,54.5 arc-90 65.1,57.5 80.1,57.5 arc-90 83.1,54.5 83.1,16.5 arc-90 80.1,13.5 65.1,13.5 arc-90
P6
  Top 1.5: JP1.P$7 22.98,78.98 18,74
  Bottom 1.5: JP1.P$7 21.98,78.98 16.42,73.42 P6.P$571
  pour Bottom (no thermals): 22,140 22,17 arc-90 19,14 3,14 arc-90 0,17 0,140 arc-90 3,143 19,143 arc-90
  pour Top: 22,140 22,17 arc-90 19,14 3,14 arc-90 0,17 0,140 arc-90 3,143 19,143 arc-90
P7
  Top 1.5: JP1.P$8 81,80.98 76,85.98 76,110
  Bottom 1.5: JP1.P$8 81,80.98 76,85.98 76,112.02
  pour Top (no thermals): 80,101 65,101 arc-90 62,104 62,142 arc-90 65,145 80,145 arc-90 83,142 83,104 arc-90
  pour Bottom (no thermals): 80,101 65,101 arc-90 62,104 62,142 arc-90 65,145 80,145 arc-90 83,142 83,104 arc-90
P8
  Top 1.5: JP1.P$9 167,82.98 162,87.98 162,113.82
  Bottom 1.5: JP1.P$9 167,82.98 162,87.98 162,115.5
  pour Bottom (no thermals): 174.7,101.4 138.7,101.4 arc-90 135.7,104.4 135.7,141.4 arc-90 138.7,144.4 174.7,144.4 arc-90 177.7,141.4 177.7,104.4 arc-90
  pour Top (no thermals): 174.7,144.4 138.7,144.4 arc90 135.7,141.4 135.7,104.4 arc90 138.7,101.4 174.7,101.4 arc90 177.7,104.4 177.7,141.4 arc90
P9
  Top 1.5: JP1.P$10 252,84.98 247,89.98 247,110
  Bottom 1.5: JP1.P$10 252,84.98 247,89.98 247,112.94
  pour Top (no thermals): 251.5,141.9 251.5,103.9 arc-90 248.5,100.9 233.5,100.9 arc-90 230.5,103.9 230.5,141.9 arc-90 233.5,144.9 248.5,144.9 arc-90
  pour Bottom (no thermals): 251.5,141.9 251.5,103.9 arc-90 248.5,100.9 233.5,100.9 arc-90 230.5,103.9 230.5,141.9 arc-90 233.5,144.9 248.5,144.9 arc-90
P10
  Top 1.5: JP1.P$11 337,86.98 332,91.98 332,115.04
  Bottom 1.5: JP1.P$11 337,86.98 332,91.98 332,115.28
  pour Bottom (no thermals): 304.3,104.5 304.3,140.5 arc-90 307.3,143.5 343.3,143.5 arc-90 346.3,140.5 346.3,104.5 arc-90 343.3,101.5 307.3,101.5 arc-90
  pour Top (no thermals): 343.3,143.5 307.3,143.5 arc90 304.3,140.5 304.3,104.5 arc90 307.3,101.5 343.3,101.5 arc90 346.3,104.5 346.3,140.5 arc90
P11
  Top 1.5: JP1.P$12 421,88.98 416,93.98 416,110.46
  Bottom 1.5: JP1.P$12 421,88.98 416,93.98 416,111.3
  pour Bottom (no thermals): 399,105 399,141 arc-90 402,144 417,144 arc-90 420,141 420,105 arc-90 417,102 402,102 arc-90
  pour Top (no thermals): 399,105 399,141 arc-90 402,144 417,144 arc-90 420,141 420,105 arc-90 417,102 402,102 arc-90
P12+
  Top 1.5: JP1.P$13 486,94.5 486,115
  Bottom 1.5: 486,115 486,94.5 JP1.P$13
  pour Bottom (no thermals): 497.6,140 497.6,101 arc-90 494.6,98 477.2,98 arc-90 474.2,101 474.2,140 arc-90 477.2,143 494.6,143 arc-90
  pour Top (no thermals): 497.6,140 497.6,101 arc-90 494.6,98 477.2,98 arc-90 474.2,101 474.2,140 arc-90 477.2,143 494.6,143 arc-90